# Altium schematic sheet PERIPHERAL.SchDoc
size A; SheetNumber: 4; SheetTotal: 6
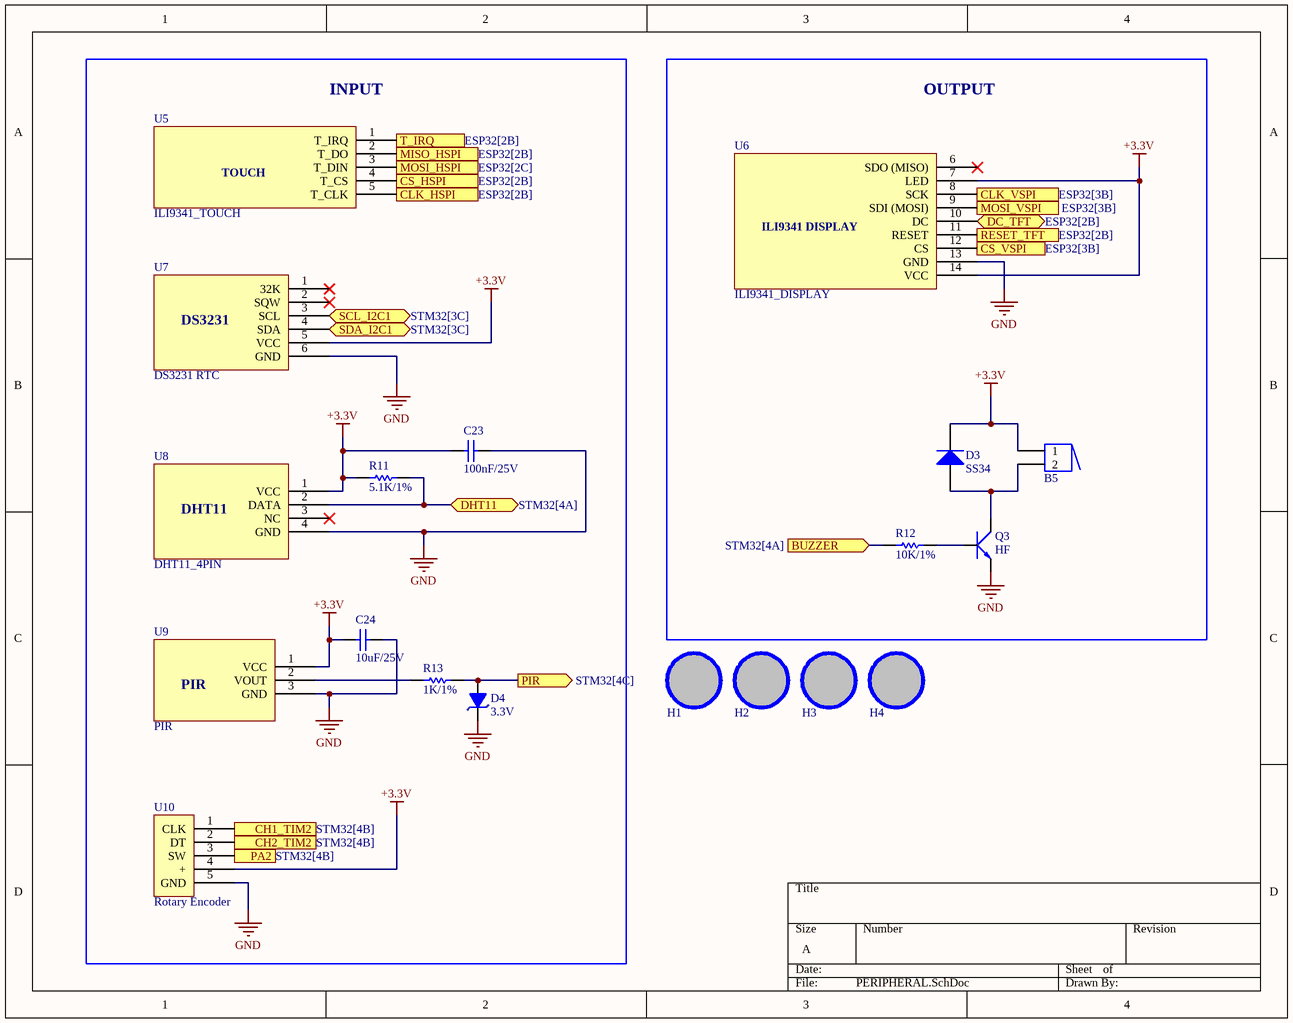
[diagram p0: PERIPHERAL.SchDoc]

## Parts
B5  Buzzer  [BUZZER]  (value not drawn)
C23  value 100nF/25V  [CAP-SM-0805]  (hidden comment: Cap Non-Pol SMD)
C24  value 10uF/25V  [CAP-SM-0805]  (hidden comment: Cap Non-Pol SMD)
D3  SS34  [DIODE SMA]
D4  3.3V  [DIODE ZENNER SMD SOD80]
H1  Hole  [LO KHOAN 3MM]  (value not drawn)
H2  Hole  [LO KHOAN 3MM]  (value not drawn)
H3  Hole  [LO KHOAN 3MM]  (value not drawn)
H4  Hole  [LO KHOAN 3MM]  (value not drawn)
Q3  HF  [SOT-23]
R11  value 5.1K/1%  [RES-SM-0805]  (hidden comment: RESISTOR SMD)
R12  value 10K/1%  [RES-SM-0805]  (hidden comment: RESISTOR SMD)
R13  value 1K/1%  [RES-SM-0805]  (hidden comment: RESISTOR SMD)
U5  ILI9341_TOUCH  [Header 5 Pin]
U6  ILI9341_DISPLAY  [HEADER 9 PIN]
U7  DS3231 RTC  [header 6 pin]
U8  DHT11_4PIN  [Header 4 Pin]
U9  PIR  [Header 3 Pin]
U10  Rotary Encoder  [Header 5 Pin]

## Blocks framed on the sheet
INPUT: C23 C24 D4 R11 R13 U5 U7-U10
OUTPUT: B5 D3 Q3 R12 U6

## Ports
BUZZER (in, see STM32[4A]), CH1_TIM2 (out, see STM32[4B]), CH2_TIM2 (out, see STM32[4B]), CLK_HSPI (in, see ESP32[2B]), CLK_VSPI (in, see ESP32[3B]), CS_HSPI (in, see ESP32[2B]), CS_VSPI (in, see ESP32[3B]), DC_TFT (bidir, see ESP32[2B]), DHT11 (bidir, see STM32[4A]), MISO_HSPI (out, see ESP32[2B]), MOSI_HSPI (in, see ESP32[2C]), MOSI_VSPI (in, see ESP32[3B]), PA2 (out, see STM32[4B]), PIR (out, see STM32[4C]), RESET_TFT (in, see ESP32[2B]), SCL_I2C1 (bidir, see STM32[3C]), SDA_I2C1 (bidir, see STM32[3C]), T_IRQ (out, see ESP32[2B])

## Nets
+3.3V: B5.1 C23.2 C24.2 D3.2(K) R11.2 U6.7(LED) U6.14(VCC) U7.5(VCC) U8.1(VCC) U9.1(VCC) U10.4(+)
GND: C23.1 C24.1 D4.2(K) Q3.2(E) U6.13(GND) U7.6(GND) U8.4(GND) U9.3(GND) U10.5(GND)
BUZZER: R12.1 ; port BUZZER
CH1_TIM2: U10.1(CLK) ; port CH1_TIM2
CH2_TIM2: U10.2(DT) ; port CH2_TIM2
CLK_HSPI: U5.5(T_CLK) ; port CLK_HSPI
CLK_VSPI: U6.8(SCK) ; port CLK_VSPI
CS_HSPI: U5.4(T_CS) ; port CS_HSPI
CS_VSPI: U6.12(CS) ; port CS_VSPI
DC_TFT: U6.10(DC) ; port DC_TFT
DHT11: R11.1 U8.2(DATA) ; port DHT11
MISO_HSPI: U5.2(T_DO) ; port MISO_HSPI
MOSI_HSPI: U5.3(T_DIN) ; port MOSI_HSPI
MOSI_VSPI: U6.9(SDI_(MOSI)) ; port MOSI_VSPI
PA2: U10.3(SW) ; port PA2
PIR: D4.1(A) R13.2 ; port PIR
RESET_TFT: U6.11(RESET) ; port RESET_TFT
SCL_I2C1: U7.3(SCL) ; port SCL_I2C1
SDA_I2C1: U7.4(SDA) ; port SDA_I2C1
T_IRQ: U5.1(T_IRQ) ; port T_IRQ
NetB5_2: B5.2 D3.1(A) Q3.3(C)
NetQ3_1: Q3.1(B) R12.2
NetR13_1: R13.1 U9.2(VOUT)

Not connected (* = marked no-connect by the designer): H1 1; H2 1; H3 1; H4 1; U6 6(SDO_(MISO))*; U7 1(32K)* 2(SQW)*; U8 3(NC)*

## Notes on the sheet
- (in symbol DHT11_4PIN) DHT11
- (in symbol ILI9341_DISPLAY) ILI9341 DISPLAY
- (in symbol ILI9341_TOUCH) TOUCH

## Library data of the parts
C23 C24 = Cap Non-Pol SMD: Capacitor
D3 = Diode SS34 ( 1N5822 ): Dán; Don_Vi: Con; Ma_Hang: MH002104; Ten_Linh_Kien: Diode SS34 3A 40V SMA ( 1N5822 SS34A); Kieu_Chan: *; Chung_Loai: Dán
D4 = Diode Zener 3.3V: Dán; Don_Vi: Con; Ma_Hang: MH002880; Ten_Linh_Kien: Diode Zener 1/2W 3.3V SMD1206 ZMM3.3; Kieu_Chan: *; Ghi_Chu: *; Chung_Loai: Dán
H1-H4 = Hole: Hole 3mm
Q3 = Trans C1815 HF SMD: SOT-23; Value: C9014
R11-R13 = RESISTOR SMD: Resistor
U7 = DS3231: DS3231 RTC Module